# Altium schematic sheet HPC_FMC.SchDoc: Audio Research: HPC FMC Connector
size A4; DrawnBy: Connor Dack; Engineer: Connor Dack; DocumentNumber: 4; Revision: 0.0; SheetNumber: 4; SheetTotal: 13
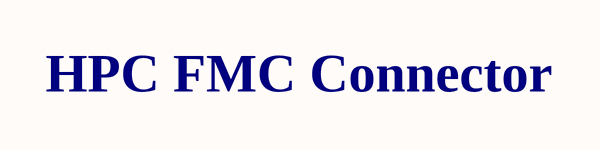
[diagram p0: HPC_FMC.SchDoc]

## Notes on the sheet
- HPC FMC Connector
- Title:
- Sheet:
- of
- Size:
- A4
- Rev:
- Date:
- Engineer:
- Time:
- File: